# EAGLE design FTDI_SmartBasic (EAGLE 6.5.0)
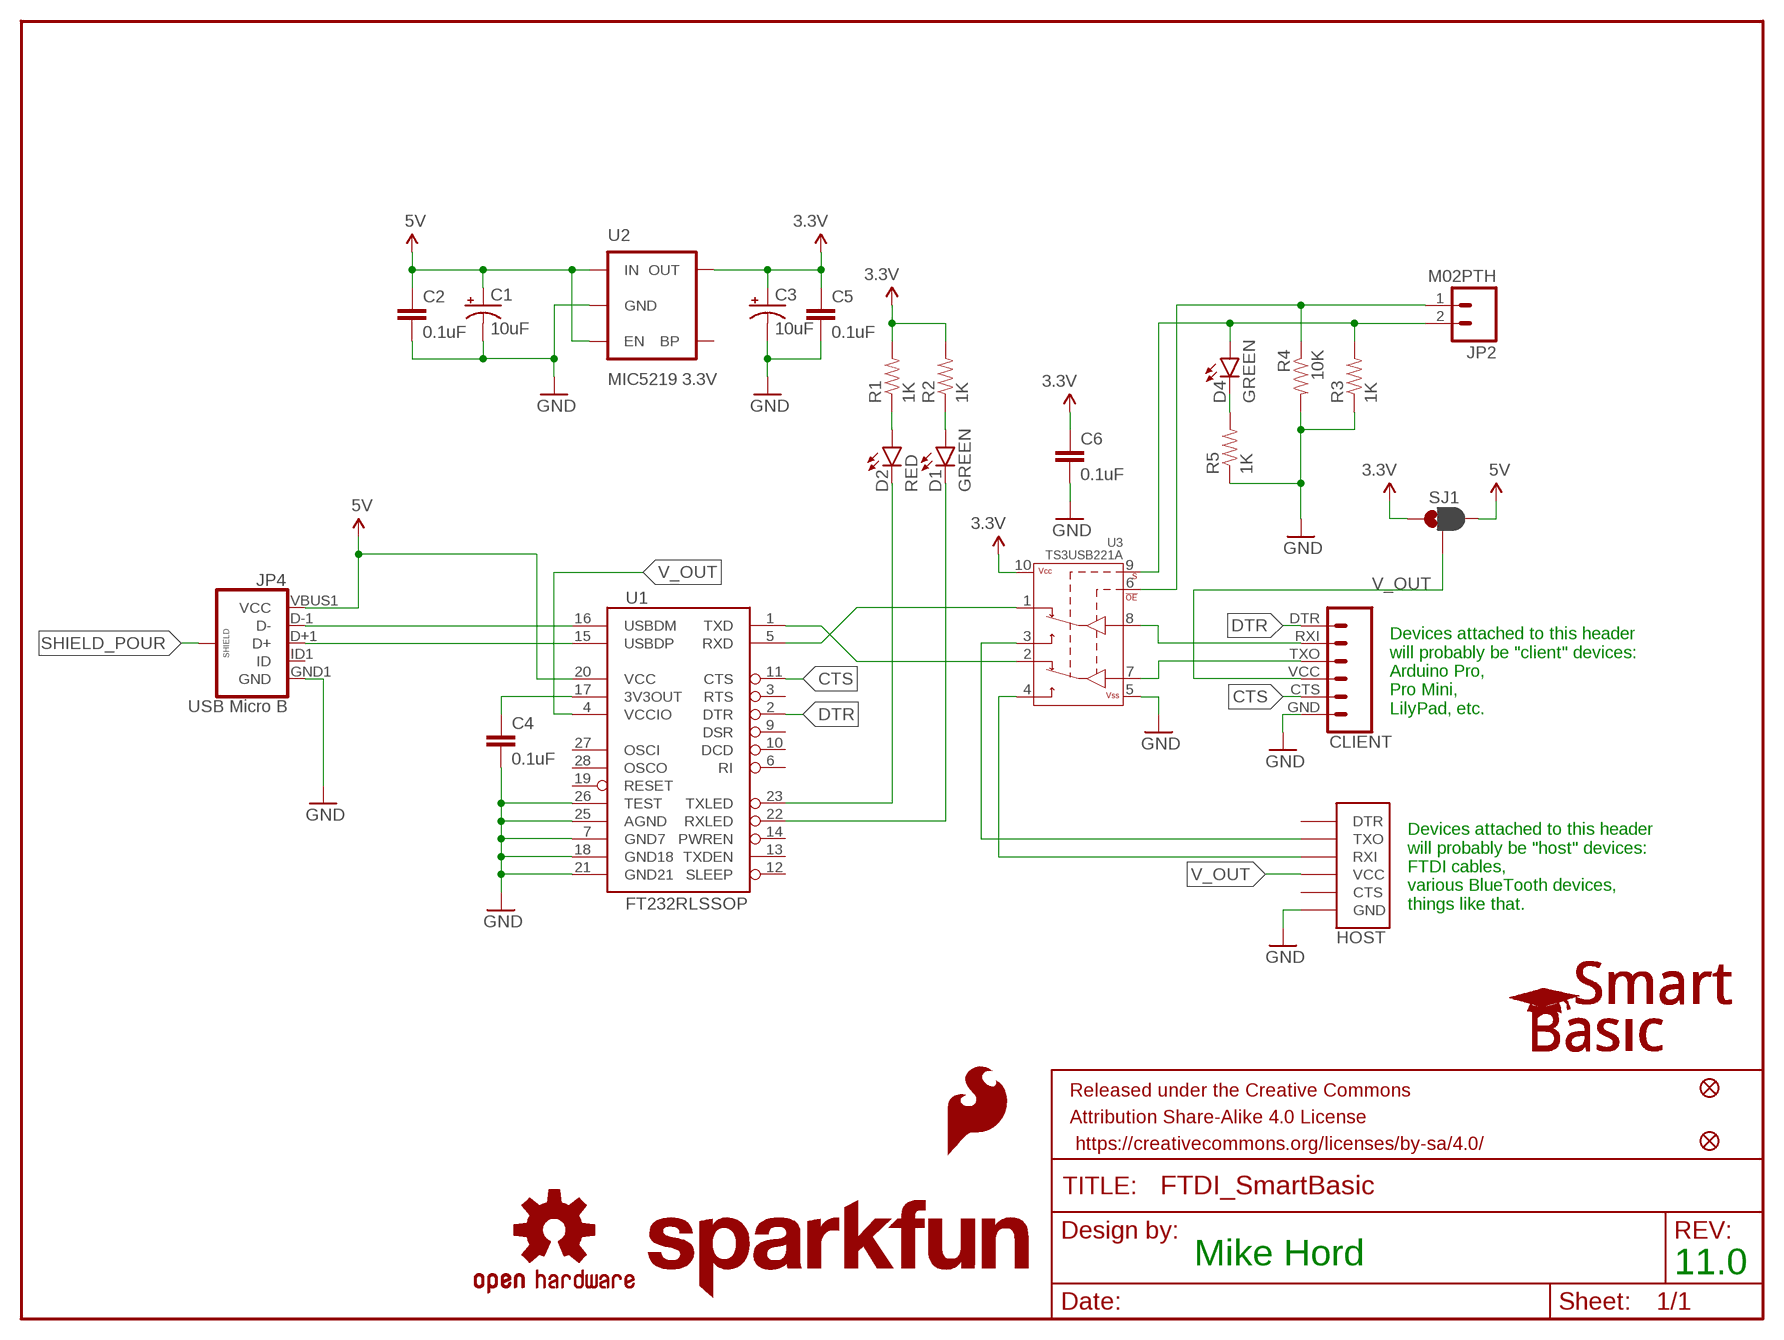
[diagram p0: schematic, sheet 1]

## Parts
C1  10uF  10UF-16V-10%(TANT)  [EIA3216]
C2  0.1uF  0.1UF-25V(+80/-20%)(0603)  [0603-CAP]
C3  10uF  10UF-16V-10%(TANT)  [EIA3216]
C4  0.1uF  0.1UF-25V(+80/-20%)(0603)  [0603-CAP]
C5  0.1uF  0.1UF-25V(+80/-20%)(0603)  [0603-CAP]
C6  0.1uF  0.1UF-25V(+80/-20%)(0603)  [0603-CAP]
CLIENT  FTDI_BASICPTH  [FTDI_BASIC]
D1  GREEN  LED-GREEN0603  [LED-0603]
D2  RED  LED-RED0603  [LED-0603]
D4  GREEN  LED-GREEN0603  [LED-0603]
FID1  FIDUCIAL1X2  [FIDUCIAL-1X2]
FID2  FIDUCIAL1X2  [FIDUCIAL-1X2]
FRAME1  FRAME-LETTER  [CREATIVE_COMMONS]
HOST  FTDI_DEVICE  [FTDI_DEVICE_SIDE]
JP2  M02PTH  [1X02]
JP4  USB Micro B  USB_MICROB_PLUGCONN-11752  [USB-B-MICRO-SMD_V03]
LOGO1  SFE_LOGO_NAME.1_INCH  [SFE_LOGO_NAME_.1]
LOGO2  SFE_LOGO_FLAME.2_INCH  [SFE_LOGO_FLAME_.2]
LOGO3  OSHW-LOGOS  [OSHW-LOGO-S]
R1  1K  1KOHM1/10W1%(0603)  [0603-RES]
R2  1K  1KOHM1/10W1%(0603)  [0603-RES]
R3  1K  1KOHM1/10W1%(0603)  [0603-RES]
R4  10K  10KOHM1/10W1%(0603)0603  [0603-RES]
R5  1K  1KOHM1/10W1%(0603)  [0603-RES]
SJ1  JUMPER-PAD-3-2OF3_NC_BY_PASTE  [PAD-JUMPER-3-2OF3_NC_BY_PASTE_YES_SILK_FULL_BOX]
U1  FT232RLSSOP  [SSOP28DB]
U2  MIC5219 3.3V  V_REG_MIC52193.3V  [SOT23-5]
U3  TS3USB221A  [QFN-10-RSE]
U$1  SMART_BASIC_LOGO  [SMART_BASIC_LOGO]

## Nets
3.3V: C3.A(+) C5.1 C6.1 R1.2 R2.2 SJ1.1 U2.5(OUT) U3.10(VCC)
5V: C1.A(+) C2.1 JP4.VBUS1(VCC) SJ1.3 U1.20(VCC) U2.1(IN) U2.3(EN)
!OE: JP2.1 R4.1 U3.6(!OE)
CTS: CLIENT.CTS U1.11(CTS)
DTR: CLIENT.DTR U1.2(DTR)
GND: C1.C(-) C2.2 C3.C(-) C4.2 C5.2 C6.2 CLIENT.GND HOST.P$6(GND) JP4.GND1(GND) R3.1 R4.2 R5.1 U1.7(GND7) U1.18(GND18) U1.21(GND21) U1.25(AGND) U1.26(TEST) U2.2(GND) U3.5(VSS)
N$1: JP4.D-1(D-) U1.16(USBDM)
N$2: C4.1 U1.17(3V3OUT)
N$3: JP4.D+1(D+) U1.15(USBDP)
N$4: D4.C R5.2
N$5: D2.A R1.1
N$6: D1.A R2.1
N$11: U1.5(RXD) U3.1(1D+)
N$12: U1.1(TXD) U3.2(1D-)
N$13: CLIENT.RXI U3.8(D+)
N$14: CLIENT.TXO U3.7(D-)
N$16: HOST.P$2(TXO) U3.3(2D+)
N$17: HOST.P$3(RXI) U3.4(2D-)
RXLED: D1.C U1.22(RXLED)
SELECT: D4.A JP2.2 R3.2 U3.9(S)
SHIELD_POUR: JP4.SHIELD1(SHIELD) JP4.SHIELD2(SHIELD) JP4.SHIELD3(SHIELD)
TXLED: D2.C U1.23(TXLED)
V_OUT: CLIENT.VCC HOST.P$4(VCC) SJ1.2 U1.4(VCCIO)
Unconnected: HOST.P$1(DTR) HOST.P$5(CTS) JP4.ID1(ID) U1.3(RTS) U1.6(RI) U1.9(DSR) U1.10(DCD) U1.12(SLEEP) U1.13(TXDEN) U1.14(PWREN) U1.19(RESET) U1.27(OSCI) U1.28(OSCO) U2.4(BP)

## Notes on the sheet
- Devices attached to this header
  will probably be "client" devices:
  Arduino Pro,
  Pro Mini,
  LilyPad, etc.
- Devices attached to this header
  will probably be "host" devices:
  FTDI cables,
  various BlueTooth devices,
  things like that.
- Mike Hord | 11.0

## Library data of the parts
C1 C3 = SparkFun-Capacitors:10UF-16V-10%(TANT): CAP-00811 1206/EIA-3216 Tantalum capacitor; PROD_ID: CAP-00811
C2 C4-C6 = SparkFun-Capacitors:0.1UF-25V(+80/-20%)(0603): CAP-00810 Ceramic Standard decoupling cap; PROD_ID: CAP-00810
CLIENT = SparkFun-Connectors:FTDI_BASIC: FTDI Basic header with labels
D1 D4 = SparkFun-LED:LED-GREEN: Various green LEDs Green LEDs used in SFE Production 0603- DIO-00821 LARGE- DIO-00862 LILYPAD- DIO-09910; PROD_ID: DIO-00821
D2 = SparkFun-LED:LED-RED: Assorted Red LEDs LilyPad 1206- DIO-09912 1206- DIO-00809 0603- DIO-00819; PROD_ID: DIO-00819
FID1 FID2 = SparkFun-Aesthetics:FIDUCIAL: Fiducial Alignment Points Various fiducial points for machine vision alignment.
FRAME1 = SparkFun-Aesthetics:FRAME-LETTER: Schematic Frame Standard 8.5x11 US Letter frame
HOST = SparkFun-Connectors:FTDI_DEVICE: Connector which mates to FTDI basic or FTDI cable.
JP2 = SparkFun-Connectors:M02: Standard 2-pin 0.1" header. Use with - straight break away headers ( PRT-00116) - right angle break away headers (PRT-00553) - swiss pins (PRT-00743) - machine pins (PRT-00117) - female headers (PRT-00115) Molex polarized connector foot print use with: PRT-08233 with associated crimp pins and housings. 2.54_SCREWTERM for use with PRT-10571. 3.5mm Screw Terminal footprints for PRT-08084 5mm Screw Terminal footprints for use with PRT-08433
JP4 = SparkFun-Connectors:USB_MICROB_PLUG: USB Micro-B connectors Some male, some female. Watch your step!; PROD_ID: CONN-11752
LOGO1 = SparkFun-Aesthetics:SFE_LOGO_NAME: SFE Logo, name only This is the SparkFun name logo. The logo on the schematic will always be the same size; the package variant is the height of the flame part of the logo (or the height the flame would be, if it were drawn). Default layer for the logo on the board is tSilk.
LOGO2 = SparkFun-Aesthetics:SFE_LOGO_FLAME: SFE Logo, flame only This is the SparkFun flame logo. The logo on the schematic will always be the same size; the package variant is the height of the flame. Default layer for the logo on the board is tSilk.
LOGO3 = SparkFun-Aesthetics:OSHW-LOGO: Open Source Hardware Logo This logo indicates the piece of hardware it is found on incorporates a OSHW license and/or adheres to the definition of open source hardware found here: http://freedomdefined.org/OSHW
R1-R3 R5 = SparkFun-Resistors:1KOHM1/10W1%(0603): RES-07856; PROD_ID: RES-07856
R4 = SparkFun-Resistors:10KOHM1/10W1%(0603): RES-00824; PROD_ID: RES-00824
SJ1 = SparkFun-Passives:JUMPER-PAD-3-2OF3_NC_BY_PASTE
U1 = SparkFun-DigitalIC:FT232RL: USB UART FT232RL 4th Generation USB UART (USB <-> Serial) Controller. Spark Fun Electronics SKU : COM-00650 Production SKU IC-00870; PROD_ID: IC-00870
U2 = SparkFun-PowerIC:V_REG_MIC5219: V_REG MIC5219 Standard 3.3V and 5V 500mA LDO voltage regulator in SOT-23 layout. Micrel part MIC5219. BP (by-pass) pin is used to lower output noise with 470pF cap, may be left open.; PROD_ID: VREG-09872
U3 = SparkFun-AnalogIC:TS3USB221A: DPDT Analog Mux Vcc 2.5 to 3.3V Passes up to 5.5V at 3.3V supply 900MHz BW, 6Ω switch resistance; PROD_ID: IC-12115
U$1 = SparkFun-Aesthetics:SMART_BASIC_LOGO

## Board
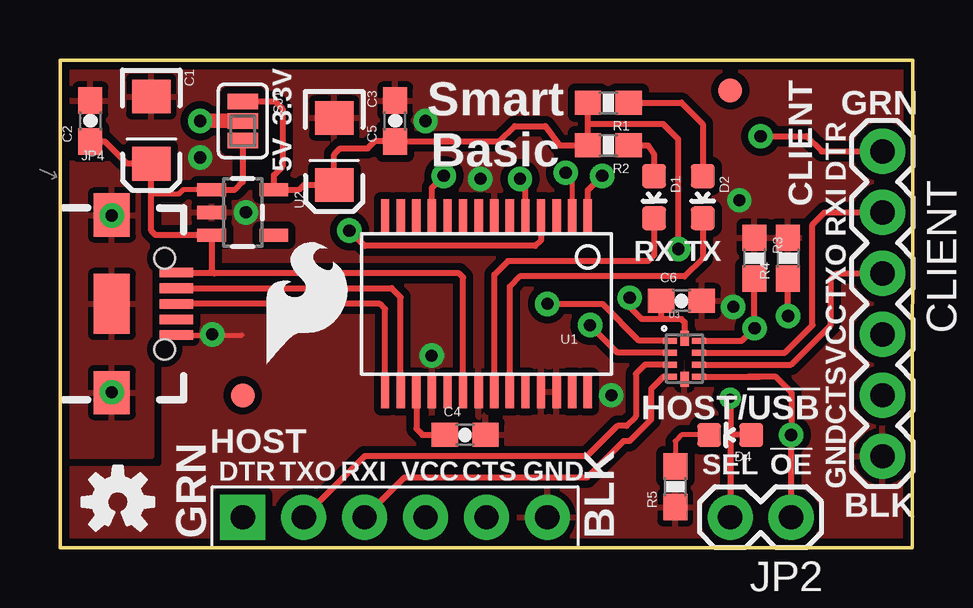
[diagram p1: board, top side]
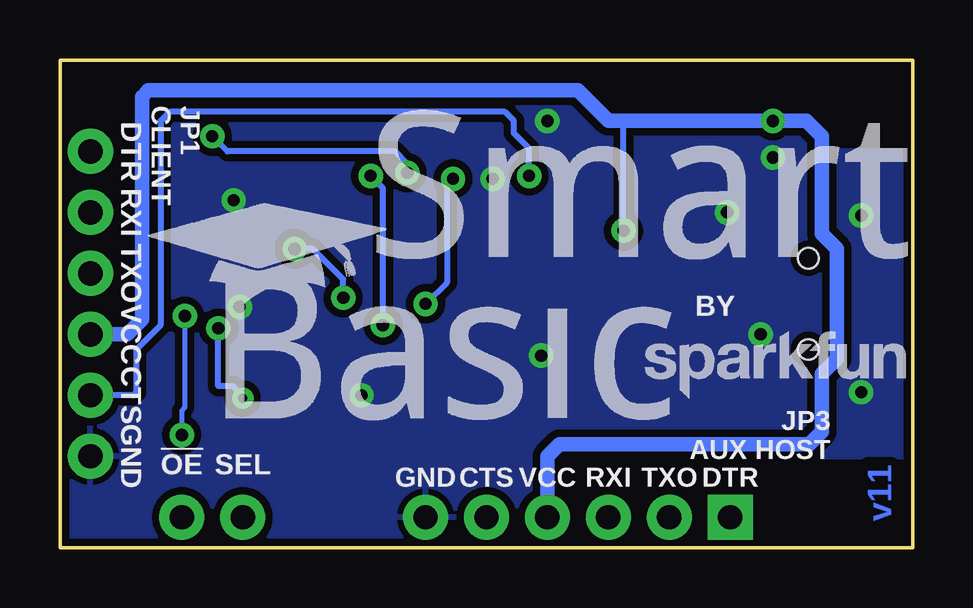
[diagram p2: board, bottom side, seen from below]

Size 35.56 x 20.32 mm. Coordinates in mm from the lower left corner, seen from the top.
Outline: 0,0 35.54,0 35.56,20.32 0,20.32 0,0
Copper layers (1*16): Top 0.035mm / dielectric 1.5mm / Bottom 0.035mm
Design rules "Sparkfun *": minimum track width 8mil, minimum drill 20mil, track to track 8mil, track to pad 8mil, pad to pad 8mil, via to via 8mil, smd to smd 8mil, copper to edge 8mil, drill to drill 8mil, minimum pad ring 12mil, minimum via ring 10mil, stop-mask expansion 4mil, vias tented up to drill 20mil, thermal gap 10mil

### Footprints (pad centres in the part's own frame; a part is rotated, then mirrored left to right if it is on the bottom)
EIA3216 = smd 1.4 x 1.6: A 1.4,0; C -1.4,0
0603-CAP = smd 1.1 x 1: 1 -0.85,0; 2 0.85,0
FTDI_BASIC = drill 1.016 pad 1.88: CTS 10.16,0; DTR 0,0; GND 12.7,0; RXI 2.54,0; TXO 5.08,0; VCC 7.62,0
LED-0603 = smd 1 x 1: A 0,-0.877; C 0,0.877
FIDUCIAL-1X2 = smd 1 x 1: 1 0,0
FTDI_DEVICE_SIDE = drill 1.016 pad 1.88 square: P$1 -6.35,0 | drill 1.016 pad 1.88: P$2 -3.81,0; P$3 -1.27,0; P$4 1.27,0; P$5 3.81,0; P$6 6.35,0
1X02 = drill 1.016 pad 1.88: 1 0,0; 2 2.54,0
USB-B-MICRO-SMD_V03 = smd 1.4 x 0.4: D+1 2.7,0; D-1 2.7,0.65; GND1 2.7,-1.3; ID1 2.7,-0.65; VBUS1 2.7,1.3 | smd 1.5 x 1.8: SHIELD1 0,3.7; SHIELD2 0,-3.7 | smd 1.5 x 2.5: SHIELD3 0,0 | hole 0.85: 2.2,1.9; 2.2,-1.9
0603-RES = smd 1.1 x 1: 1 -0.85,0; 2 0.85,0
PAD-JUMPER-3-2OF3_NC_BY_PASTE_YES_SILK_FULL_BOX = smd 0.635 x 1.27: 1 -0.813,0; 2 0,0; 3 0.813,0
SSOP28DB = smd 0.348 x 1.397: 1 -4.225,-3.656; 2 -3.575,-3.656; 3 -2.925,-3.656; 4 -2.275,-3.656; 5 -1.625,-3.656; 6 -0.975,-3.656; 7 -0.325,-3.656; 8 0.325,-3.656; 9 0.975,-3.656; 10 1.625,-3.656; 11 2.275,-3.656; 12 2.925,-3.656; 13 3.575,-3.656; 14 4.225,-3.656; 15 4.225,3.656; 16 3.575,3.656; 17 2.925,3.656; 18 2.275,3.656; 19 1.625,3.656; 20 0.975,3.656; 21 0.325,3.656; 22 -0.325,3.656; 23 -0.975,3.656; 24 -1.625,3.656; 25 -2.275,3.656; 26 -2.925,3.656; 27 -3.575,3.656; 28 -4.225,3.656
SOT23-5 = smd 0.55 x 1.2: 1 -0.95,-1.3; 2 0,-1.3; 3 0.95,-1.3; 4 0.95,1.3; 5 -0.95,1.3
QFN-10-RSE = smd 0.58 x 0.25: 1 -0.6,0.75; 2 -0.6,0.25; 3 -0.6,-0.25; 4 -0.6,-0.75; 6 0.6,-0.75; 7 0.6,-0.25; 8 0.6,0.25; 9 0.6,0.75 | smd 0.35 x 0.63: 5 0,-0.85; 10 0,0.85

### Placement (x,y rotation side)
C1  3.81,17.4 270 top
C2  1.27,17.78 90 top
C3  11.43,16.51 270 top
C4  16.89,4.7 0 top
C5  13.97,17.78 90 top
C6  25.91,10.29 0 top
CLIENT  34.29,16.51 270 top
D1  24.77,14.61 180 top
D2  26.8,14.61 180 top
D4  27.94,4.7 90 top
FID1  7.62,6.35 0 top
FID2  27.94,19.05 0 top
FRAME1  -77.47,12.7 0 top  (outside the outline)
HOST  13.97,1.27 0 top
JP2  30.48,1.27 180 top
JP4  2.16,10.16 0 top
LOGO1  11.68,5.71 0 bottom
LOGO2  8.26,7.37 0 top
LOGO3  2.41,1.91 0 top
R1  22.86,18.54 180 top
R2  22.86,16.76 180 top
R3  28.96,12.06 270 top
R4  30.35,12.06 90 top
R5  25.65,2.54 90 top
SJ1  7.62,17.78 270 top
U1  17.78,10.16 180 top
U2  7.62,13.97 270 top
U3  26.04,7.87 0 top
U$1  32.26,3.43 0 bottom

### Tracks (layer width: path | path; a pad name or v marks a point on that pad's centre or on a via)
3.3V  (via drill 0.51)
  Top 0.254: 22.01,17.65 R2.2 20.83,16.76 20.23,17.57 18.96,17.57 18.33,16.93 C5.1 13.12,16.93 12.83,16.64 11.68,16.64 11.43,16.38 C3.A 10.16,15.11 9.97,14.92 U2.5 8.92,15.52 9.27,15.88 9.27,18.29 8.97,18.59 SJ1.1 | 22.01,17.65 R1.2 | v25.78,12.45 25.78,17.02 25.15,17.65 22.01,17.65 | U3.10 26.04,9.4 25.91,9.53 25.02,9.53 | v23.75,10.41 23.75,10.03 24.26,9.53 25.02,9.53 | C6.1 25.06,9.56 25.02,9.53
  Bottom 0.254: v23.75,10.41 23.75,11.18 25.02,12.45 v25.78,12.45
5V
  Top 0.203: U2.1 5.14,14.92 4.95,14.73 3.81,14.73
  Top 0.254: JP4.VBUS1 6.42,11.46 | C2.1 1.87,16.93 2.8,16 C1.A 3.81,14.73 3.81,13.21 4,13.02 U2.3 6.32,11.56 6.42,11.46 | SJ1.3 7.62,15.24 7.3,14.92 U2.1 | U1.20 16.8,11.26 16.64,11.43 6.45,11.43 6.42,11.46
!OE  (via drill 0.51)
  Top 0.254: U3.6 28.7,7.12 | 28.7,7.12 29.2,7.12 | JP2.1 v30.48,4.7 30.48,6.48 29.84,7.11 28.71,7.11 28.7,7.12 | v30.35,9.65 R4.1
  Bottom 0.203: v30.35,9.65 30.35,5.84 30.48,5.71 v30.48,4.7
CTS  (via drill 0.51)
  Top 0.254: U1.11 15.51,15 v16,15.49
  Bottom 0.254: v16,15.49 16,16.64 16.64,17.27 16.64,17.78 17.02,18.16 30.99,18.16 31.37,17.78 31.37,9.27 32.38,8.26 32.38,6.48 32.51,6.35 CLIENT.CTS
DTR  (via drill 0.51)
  Top 0.203: U1.2 21.36,15.35 v21.08,15.62
  Top 0.254: v29.21,17.14 31.11,17.14 31.75,16.51 CLIENT.DTR
  Bottom 0.203: v21.08,15.62 21.34,15.37
  Bottom 0.254: v21.08,15.62 21.08,16 21.59,16.51 28.57,16.51 v29.21,17.14
GND  (via drill 0.51)
  Top 0.203: JP4.GND1 7.59,8.86
  other vias: 22.99,6.35 28.32,14.48 6.35,8.89 7.75,13.97 17.53,15.37 5.84,16.26 15.24,17.78 15.49,8 28.07,10.03
  pour Bottom (isolate 0.305, rank 2): 0,20.32 35.56,20.32 35.56,0 0,0
  pour Top (isolate 0.305, rank 2): 0,20.32 35.56,20.32 35.56,0 0,0
N$1
  Top 0.254: JP4.D-1 13.83,10.81 14.21,10.43 U1.16
N$2
  Top 0.254: U1.17 14.86,4.96 15.11,4.7 C4.1
N$3
  Top 0.254: U1.15 13.55,9.94 13.34,10.16 JP4.D+1
N$4
  Top 0.203: D4.C 25.91,4.7 25.65,4.45 R5.2
N$5
  Top 0.254: R1.1 25.91,18.54 26.8,17.65 D2.A
N$6
  Top 0.254: R2.1 24.51,16.76 24.77,16.38 D1.A
N$11  (via drill 0.51)
  Top 0.254: U1.5 19.41,15.14 v19.18,15.37 | v20.32,10.16 22.61,10.16 24.14,8.62 U3.1
  Bottom 0.254: v19.18,15.37 19.43,15.11 19.43,11.05 v20.32,10.16
N$12  (via drill 0.51)
  Top 0.254: U3.2 23.25,8.12 v22.1,9.27 | U1.1 22,14.89 v22.61,15.49
  Bottom 0.254: v22.1,9.27 22.1,14.99 v22.61,15.49
N$13
  Top 0.254: U3.8 30.22,8.12 31.37,9.27 31.37,13.46 31.88,13.97 CLIENT.RXI
N$14
  Top 0.254: U3.7 30.48,7.62 32.13,9.27 32.13,11.18 32.38,11.43 CLIENT.TXO
N$16
  Top 0.254: U3.3 24.39,7.62 24,7.24 24,5.46 23.62,5.08 23.24,5.08 21.97,3.81 12.7,3.81 HOST.P$2
N$17
  Top 0.254: U3.4 25.16,7.12 24.64,6.6 24.64,5.33 23.75,4.45 23.5,4.45 21.97,2.92 14.35,2.92 HOST.P$3
RXLED
  Top 0.254: D1.C 24.77,12.19 24.51,11.94 18.67,11.94 18.11,11.37 U1.22
SELECT  (via drill 0.38, 0.51)
  Top 0.203: 28.07,4.7 27.94,4.57
  Top 0.254: U3.9 28.44,8.62 v28.96,9.14 R3.2 | 27.94,4.57 JP2.2 | D4.A 28.07,4.7 27.94,4.83 v27.94,6.22
  Bottom 0.254: v27.94,6.22 28.32,6.73 28.96,6.73 v28.96,9.14
SHIELD_POUR  (via drill 0.51)
  other vias: 2.16,6.48 2.16,13.84
  pour Top (isolate 0.305): 0,16.51 3.81,16.51 3.81,3.81 0,3.81
  pour Bottom (isolate 0.305): 0,16.51 3.81,16.51 3.81,3.81 0,3.81
TXLED
  Top 0.254: D2.C 26.8,12.06 26.04,11.3 19.18,11.3 18.75,10.88 U1.23
V_OUT  (via drill 0.51)
  Top 0.254: U1.4 20.05,12.82 19.81,12.57 12.7,12.57 v12.06,13.21
  Top 0.61: SJ1.2 v5.84,17.78
  Bottom 0.254: v12.06,13.21 12.06,17.78 12.06,17.91
  Bottom 0.61: CLIENT.VCC 32.77,8.89 32.13,9.53 32.13,18.8 31.88,19.05 13.97,19.05 12.7,17.78 12.06,17.78 v5.84,17.78 4.45,17.78 3.81,17.14 3.81,13.08 3.17,12.45 3.17,7.87 3.81,7.24 3.81,4.83 4.32,4.32 14.73,4.32 15.24,3.81 HOST.P$4

### Text on the board
Bottom: v11
tPlace: 3.3V | GRN | DTR | 5V | Smart / Basic | CLIENT | RXI | RX | TX | TXO | VCC | HOST/!USB | CTS | HOST | GND | SEL | !OE | BLK
bPlace: JP1 / CLIENT | DTR | RXI | TXO | BY | VCC | JP3 / AUX HOST | CTS | GND | DTR | TXO | RXI | VCC | CTS | GND | SEL | !OE
tDocu: M. Hord